# Altium schematic sheet SIM-LTE.SchDoc
size A; SheetNumber: 8; SheetTotal: 9
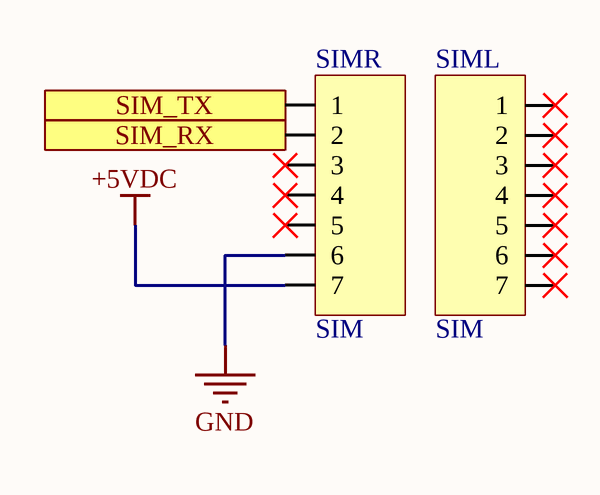
[diagram p0: SIM-LTE.SchDoc]

## Parts
SIML  SIM  [JP7-C1T]
SIMR  SIM  [JP7-C1T]

## Ports
SIM_RX (out), SIM_TX (in)

## Nets
+5VDC: SIMR.7
GND: SIMR.6
SIM_RX: SIMR.2 ; port SIM_RX
SIM_TX: SIMR.1 ; port SIM_TX

Not connected (* = marked no-connect by the designer): SIML 1* 2* 3* 4* 5* 6* 7*; SIMR 3* 4* 5*

## Library data of the parts
SIML SIMR = JP7: WR-PHD 2.54 mm Angled Socket Header; Manufacturer: W¨¹rth Elektronik eiSos GmbH; partNo: 613007143121; ComponentLink1 Description: Manufacturer; ComponentLink2 Description: Datasheet; NoPins: 07; Created Date: 29 March 2013; ComponentLink1URL: http://www.we-online.com; ComponentLink2URL: http://katalog.we-online.de/em/datasheet/6130xx143121.pdf; Created by: Karrer Zheng